# Altium schematic sheet Sheet1.SchDoc
size A4; SheetNumber: 1; SheetTotal: 1
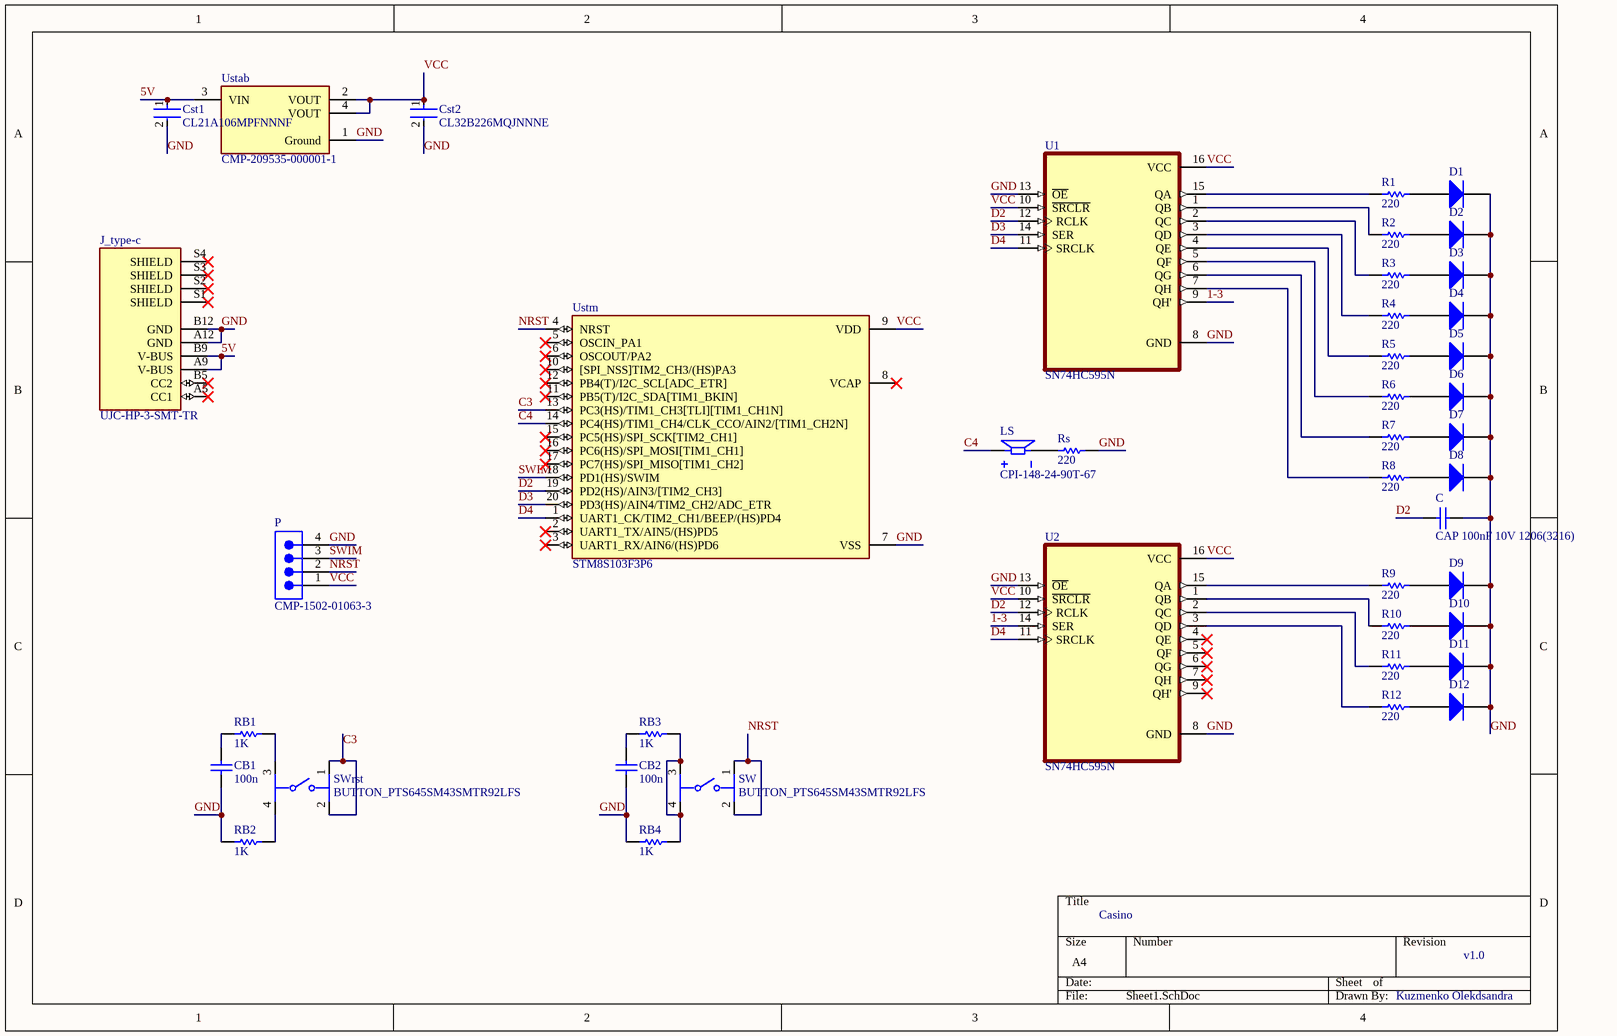
[diagram p0: Sheet1.SchDoc]

## Parts
C  CAP 100nF 10V 1206(3216)  [CAPC1206(3216)100_M]
CB1  value 100n  (hidden comment: Capacitor)
CB2  value 100n  (hidden comment: Capacitor)
Cst1  CL21A106MPFNNNF  [FP-CL21-IPC_C]
Cst2  CL32B226MQJNNNE  [FP-CL32-IPC_B]
D1  Diode  (value not drawn)
D2  Diode  (value not drawn)
D3  Diode  (value not drawn)
D4  Diode  (value not drawn)
D5  Diode  (value not drawn)
D6  Diode  (value not drawn)
D7  Diode  (value not drawn)
D8  Diode  (value not drawn)
D9  Diode  (value not drawn)
D10  Diode  (value not drawn)
D11  Diode  (value not drawn)
D12  Diode  (value not drawn)
J_type-c  UJC-HP-3-SMT-TR  [CUI_UJC-HP-3-SMT-TR]
LS  CPI-148-24-90T-67  [XDCR_CPI-148-24-90T-67]
P  CMP-1502-01063-3  [61300411021]
R1  value 220  (hidden comment: Resistor)
R2  value 220  (hidden comment: Resistor)
R3  value 220  (hidden comment: Resistor)
R4  value 220  (hidden comment: Resistor)
R5  value 220  (hidden comment: Resistor)
R6  value 220  (hidden comment: Resistor)
R7  value 220  (hidden comment: Resistor)
R8  value 220  (hidden comment: Resistor)
R9  value 220  (hidden comment: Resistor)
R10  value 220  (hidden comment: Resistor)
R11  value 220  (hidden comment: Resistor)
R12  value 220  (hidden comment: Resistor)
RB1  value 1K  (hidden comment: Resistor)
RB2  value 1K  (hidden comment: Resistor)
RB3  value 1K  (hidden comment: Resistor)
RB4  value 1K  (hidden comment: Resistor)
Rs  value 220  (hidden comment: Resistor)
SW  BUTTON_PTS645SM43SMTR92LFS  [FP-PTS645SM43SMTR92LFS-MFG]
SWrst  BUTTON_PTS645SM43SMTR92LFS  [FP-PTS645SM43SMTR92LFS-MFG]
U1  SN74HC595N  [DIP794W45P254L1969H508Q16]
U2  SN74HC595N  [DIP794W45P254L1969H508Q16]
Ustab  CMP-209535-000001-1  [FP-AMS1117-IPC_A]
Ustm  STM8S103F3P6  [SOP65P640X120-20N]

## Nets
1-3: U1.9(QH') U2.14(SER)
5V: Cst1.1 J_type-c.A9(V-BUS) J_type-c.B9(V-BUS) Ustab.3(VIN)
C3: SWrst.1 SWrst.2 Ustm.13(PC3(HS)/TIM1_CH3[TLI][TIM1_CH1N])
C4: LS.P Ustm.14(PC4(HS)/TIM1_CH4/CLK_CCO/AIN2/[TIM1_CH2N])
D2: C.1 U1.12(RCLK) U2.12(RCLK) Ustm.19(PD2(HS)/AIN3/[TIM2_CH3])
D3: U1.14(SER) Ustm.20(PD3(HS)/AIN4/TIM2_CH2/ADC_ETR)
D4: U1.11(SRCLK) U2.11(SRCLK) Ustm.1(UART1_CK/TIM2_CH1/BEEP/(HS)PD4)
GND: C.2 CB1.1 CB2.1 Cst1.2 Cst2.2 D1.2(K) D2.2(K) D3.2(K) D4.2(K) D5.2(K) D6.2(K) D7.2(K) D8.2(K) D9.2(K) D10.2(K) D11.2(K) D12.2(K) J_type-c.A12(GND) J_type-c.B12(GND) P.4 RB2.2 RB4.1 Rs.1 U1.8(GND) U1.13(~{OE}) U2.8(GND) U2.13(~{OE}) Ustab.1(Ground) Ustm.7(VSS)
NRST: P.2 SW.1 SW.2 Ustm.4(NRST)
SWIM: P.3 Ustm.18(PD1(HS)/SWIM)
VCC: Cst2.1 P.1 U1.10(~{SRCLR}) U1.16(VCC) U2.10(~{SRCLR}) U2.16(VCC) Ustab.2(VOUT) Ustab.4(VOUT) Ustm.9(VDD)
NetCB1_2: CB1.2 RB1.2
NetCB2_2: CB2.2 RB3.2
NetD1_1: D1.1(A) R1.2
NetD2_1: D2.1(A) R2.2
NetD3_1: D3.1(A) R3.2
NetD4_1: D4.1(A) R4.2
NetD5_1: D5.1(A) R5.2
NetD6_1: D6.1(A) R6.2
NetD7_1: D7.1(A) R7.2
NetD8_1: D8.1(A) R8.2
NetD9_1: D9.1(A) R9.2
NetD10_1: D10.1(A) R10.2
NetD11_1: D11.1(A) R11.2
NetD12_1: D12.1(A) R12.2
NetLS_N: LS.N Rs.2
NetR1_1: R1.1 U1.15(QA)
NetR2_1: R2.1 U1.1(QB)
NetR3_1: R3.1 U1.2(QC)
NetR4_1: R4.1 U1.3(QD)
NetR5_1: R5.1 U1.4(QE)
NetR6_1: R6.1 U1.5(QF)
NetR7_1: R7.1 U1.6(QG)
NetR8_1: R8.1 U1.7(QH)
NetR9_1: R9.1 U2.15(QA)
NetR10_1: R10.1 U2.1(QB)
NetR11_1: R11.1 U2.2(QC)
NetR12_1: R12.1 U2.3(QD)
NetRB1_1: RB1.1 SWrst.3
NetRB2_1: RB2.1 SWrst.4
NetRB3_1: RB3.1 RB4.2 SW.3 SW.4

Not connected (* = marked no-connect by the designer): J_type-c A5(CC1)* B5(CC2)* S1(SHIELD)* S2(SHIELD)* S3(SHIELD)* S4(SHIELD)*; U2 4(QE)* 5(QF)* 6(QG)* 7(QH)* 9(QH')*; Ustm 2(UART1_TX/AIN5/(HS)PD5)* 3(UART1_RX/AIN6/(HS)PD6)* 5(OSCIN_PA1)* 6(OSCOUT/PA2)* 8(VCAP)* 10([SPI_NSS]TIM2_CH3/(HS)PA3)* 11(PB5(T)/I2C_SDA[TIM1_BKIN])* 12(PB4(T)/I2C_SCL[ADC_ETR])* 15(PC5(HS)/SPI_SCK[TIM2_CH1])* 16(PC6(HS)/SPI_MOSI[TIM1_CH1])* 17(PC7(HS)/SPI_MISO[TIM1_CH2])*

## Notes on the sheet
- Casino
- v1.0
- Kuzmenko Olekdsandra

## Library data of the parts
C = CMP-1037-04172-1: CAP 100nF 10V ±5% 1206 (3216 Metric) Thickness 1mm SMD; Case-Metric: 3216; Case-EIA: 1206; Tolerance: Â±5%; Max Thickness: 1 mm; Rated Voltage: 10 V; Technology: SMT; Value: 100nF
CB1 CB2 = Capacitor: SimulationGenericComponent: True
Cst1 = CMP-13271-002245-1: CL21 Series 0805 10uF 10V ±20% Tolerance X5R Multilayer Ceramic Chip Capacitor; Voltage Rating (DC): 10V; Mount: Surface Mount; Tolerance: 20%; Case/Package: 0805; Voltage Rating: 10V; Dielectric: X5R; Max Operating Temperature: 85°C; Packaging: Tape and Reel; Capacitance: 10uF; Height: 1.25mm; Thickness: 0.053inch; Width: 0.049inch; Length: 2mm; Radiation Hardening: No; Min Operating Temperature: -55°C; Depth: 1.25mm; Package Quantity: 10000
Cst2 = CMP-13271-001877-1: Cap Ceramic 22uF 6.3V X7R ±20% SMD 1210 +125°C Embossed T/R; Radiation Hardening: No; Case Code (Metric): 3225; Tolerance: 20%; Dielectric: X7R; Voltage Rating (DC): 6.3V; Package Quantity: 1; Lead Free: Lead Free; Max Operating Temperature: 125°C; Height: 2.5mm; Thickness: 0.106inch; Case Code (Imperial): 1210; Voltage Rating: 6.3V; Packaging: Tape and Reel; Capacitance: 22uF; Length: 3.2mm; Min Operating Temperature: -55°C; Depth: 2.5mm; Case/Package: 1210; Width: 0.098inch; Mount: Surface Mount
D1-D12 = Diode: AF: 1; BV: 0; BV_MAX: 1e99; EG: 1.11; FC: 0.5; IBV: 0.001; ISR: 1e-14; MJSW: 0.33; NTUN: 30; TNOM: 27; XTI: 3; SimulationGenericComponent: True; CJO: 0; CJP: 0; CTA: 0; CTP: 0; FCS: 0.5; FV_MAX: 1e99; IKF: 0; IKR: 0; JSW: 0; JTUN: 0; JTUNSW: 0; KEG: 1; KF: 0; LEVEL: 1; N: 1; NBV: 1; NR: 1; NS: 1; PHP: 1; RS: 0; TCV: 0; TLEV: 0; TLEVC: 0; TM1: 0; TM2: 0; TPB: 0; TPHP: 0; TRS: 0; TRS2: 0; TT: 0; TTT1: 0; TTT2: 0; VJ: 1; XTITUN: 3; IS: 1e-14
J_type-c = CMP-039-000001-1: Price: None; Source: UJC-HP-3-SMT-TR.SchLib; Value: *; Availability: Unavailable; Pin Count: 10; MP: UJC-HP-3-SMT-TR; Design Item ID: UJC-HP-3-SMT-TR; Component Type: Standard; Package: None
LS = CMP-037-000001-1: 13,9 РјРј, 24 Р’ РїРѕСЃС‚. С‚РѕРєР°, 90 РґР‘, СЃРєРІРѕР·РЅРѕРµ РѕС‚РІРµСЂСЃС‚РёРµ, РїСЊРµР·РѕСЌР»РµРєС‚СЂРёС‡РµСЃРєРёР№ Р·РІСѓРєРѕРІРѕР№ РёРЅРґРёРєР°С‚РѕСЂ; MF: Same Sky; Package: None; Pin Count: 2; Design Item ID: CPI-148-24-90T-67; Value: *; Component Type: Standard; Source: CPI-148-24-90T-67.SchLib; MP: CPI-148-24-90T-67; SnapEDA_Link: https://www.snapeda.com/parts/CPI-148-24-90T-67/Same+Sky/view-part/?ref=snap; Check_prices: https://www.snapeda.com/parts/CPI-148-24-90T-67/Same+Sky/view-part/?ref=eda
P = CMP-043-000001-1: NexarPartId: 31153320; Operating Supply Voltage: 250V; Gender: Male; Contact Resistance: 20m?; Number of Contacts: 4; Connector Type: Male Pin; Current Rating: 3A; Pitch: 2.54mm; RoHS: Compliant; REACH SVHC: Unknown; Pin Count: 4; Component Type: Standard; Source: Components - 25.08.25 - 11.48.SchLib; Contact Plating: Gold; Number of Positions: 4; Design Item ID: CMP-1502-01063-3; Number of Pins: 4; Termination: Solder; Color: Black; Contact Material: Copper; Contact Mating Length: 5.9944mm; Mount: Through Hole; Number of Rows: 1; Lead Pitch: 2.54mm
R1-R12 RB1-RB4 Rs = Resistor: TC1: 0; SimulationGenericComponent: True; TC2: 0
SW SWrst = CMP-00012-1: Keypad Switch, 1 Switches, SPST, Momentary-tactile, 0.05A, 12VDC, 1.57N, 4 PCB Hole Cnt, Solder Terminal, Surface Mount-straight; Body Breadth: 5.9944mm; Dielectric Withstand Volts: 250VACV; Contact Resistance: 0.1mR; Contact Voltage(DC)-Max: 12V; Insulation Resistance: 100GR; Contact Current(DC)-Max: 50mA; Actuator Type: Pushbutton; Contact DC Max Rating R Load: 0.05A@12VDC; Body Height: 3.4544mm; PCB Hole Count: 4; Switch Type: Keypad; Termination: Solder; Switch Action: MOMENTARY; Min Operating Temperature: -20°C; Mounting Technology: Surface Mount; Max Operating Temperature: 60°C; Terminal Finish: Silver; Terminal Length: 0.138inch; Reach SVHC Compliant: Yes; Switch Function: SPST; RoHS Compliant: Yes; Body Length or Diameter: 5.9944mm; JESD-609 Code: e4
U1 U2 = CMP-029-000001-1: 8-bit shift registers with 3-state output registers; MF: Texas Instruments; MP: SN74HC595N; Package: PDIP-16 Texas Instruments; Component Type: Standard; SnapEDA_Link: https://www.snapeda.com/parts/SN74HC595N/Texas+Instruments/view-part/?ref=snap; Value: *; Check_prices: https://www.snapeda.com/parts/SN74HC595N/Texas+Instruments/view-part/?ref=eda; Design Item ID: SN74HC595N; Pin Count: 16; Source: SN74HC595N.SchLib
Ustab = CMP-067-000000-1: LDO Voltage Regulators 1A, 3.3V; Manufacturer: Advanced Monolithic Systems; Manufacturer Part Number: AMS1117-3.3; Number Of Outputs: 1; Max Supply Voltage: 15V; Output Type: Fixed; Dropout Voltage: 1.1V; Standoff Height: 0.64mm; Max Junction Temp: +125°C; Max Power Dissipation: 1.2W; Nominal Supply Current: 5mA; Lead Free: Yes; Pin Count: 4; Device Class L1: Integrated Circuits (ICs); Design Item ID: CMP-209535-000001-1; RoHS: TRUE; Source: Components - 25.08.25 - 12.03.SchLib; Output Current: 1A; Octopart: https://octopart.com/ams1117-3.3-advanced+monolithic+systems-25899300; Temperature: -40°C to +125°C; Component Type: Standard; Temperature Range High: 125°C; Height: 1.8mm; Ipc Land Pattern Name: SOT229P700X180-4; Package: AMS1117; Device Class L3: Voltage Regulators - Linear; Category: IC; Output Voltage: 3.3V; Device Class L2: Power Management ICs; Automotive: No; Temperature Range Low: -40°C
Ustm = CMP-031-00014-1: STM8 series Microcontroller IC 8-Bit 16MHz 8KB (8K x 8) FLASH 20-TSSOP; MF: STMicroelectronics; Value: *; MP: STM8S103F3P6; Component Type: Standard; Case/Package: TSSOP-20 STMicroelectronics; Pins: 20; Check_prices: https://www.snapeda.com/parts/STM8S103F3P6/STMicroelectronics/view-part/?ref=eda; SnapEDA_Link: https://www.snapeda.com/parts/STM8S103F3P6/STMicroelectronics/view-part/?ref=snap; Design Item ID: STM8S103F3P6; Source: STM8S103F3P6.SchLib